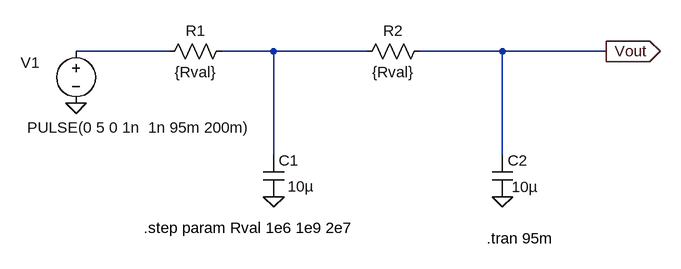
[diagram p0: schematic rc_ladder_open_sweep.asc]
rc_ladder_open_sweep.asc, the LTspice schematic file:
Version 4.1
SHEET 1 880 680
WIRE 80 160 -64 160
WIRE 240 160 160 160
WIRE 384 160 240 160
WIRE 592 160 464 160
WIRE 752 160 592 160
WIRE 240 320 240 160
WIRE 592 320 592 160
FLAG -64 240 0
FLAG 240 384 0
FLAG 752 160 Vout
IOPIN 752 160 Out
FLAG 592 384 0
SYMBOL voltage -64 144 R0
WINDOW 0 -85 33 Left 2
WINDOW 3 -75 133 Left 2
WINDOW 123 0 0 Left 0
WINDOW 39 0 0 Left 0
SYMATTR InstName V1
SYMATTR Value PULSE(0 5 0 1n  1n 95m 200m)
SYMBOL res 176 144 R90
WINDOW 0 0 56 VBottom 2
WINDOW 3 32 56 VTop 2
SYMATTR InstName R1
SYMATTR Value {Rval}
SYMBOL cap 224 320 R0
WINDOW 3 38 48 Left 2
SYMATTR Value 10µ
SYMATTR InstName C1
SYMATTR SpiceLine V=6.3 Irms=0 Rser=4 Lser=0 mfg="AVX" pn="TAJA106M006" type="Tantalum"
SYMBOL res 480 144 R90
WINDOW 0 0 56 VBottom 2
WINDOW 3 32 56 VTop 2
SYMATTR InstName R2
SYMATTR Value {Rval}
SYMATTR SpiceLine tol=1 pwr=0.1
SYMBOL cap 576 320 R0
WINDOW 3 30 49 Left 2
SYMATTR Value 10µ
SYMATTR InstName C2
SYMATTR SpiceLine V=6.3 Irms=0 Rser=4 Lser=0 mfg="AVX" pn="TAJA106M006" type="Tantalum"
TEXT 568 448 Left 2 !.tran 95m
TEXT 40 432 Left 2 !.step param Rval 1e6 1e9 2e7

The netlist it stands for:
* rc_ladder_open_sweep.asc
V1 N001 0 PULSE(0 5 0 1n  1n 95m 200m)
R1 N002 N001 {Rval}
C1 N002 0 10µ V=6.3 Irms=0 Rser=4 Lser=0 mfg="AVX" pn="TAJA106M006" type="Tantalum"
R2 Vout N002 {Rval} tol=1 pwr=0.1
C2 Vout 0 10µ V=6.3 Irms=0 Rser=4 Lser=0 mfg="AVX" pn="TAJA106M006" type="Tantalum"
.tran 95m
.step param Rval 1e6 1e9 2e7
.backanno
.end